# EAGLE design algo_fet16 (EAGLE 4.16)
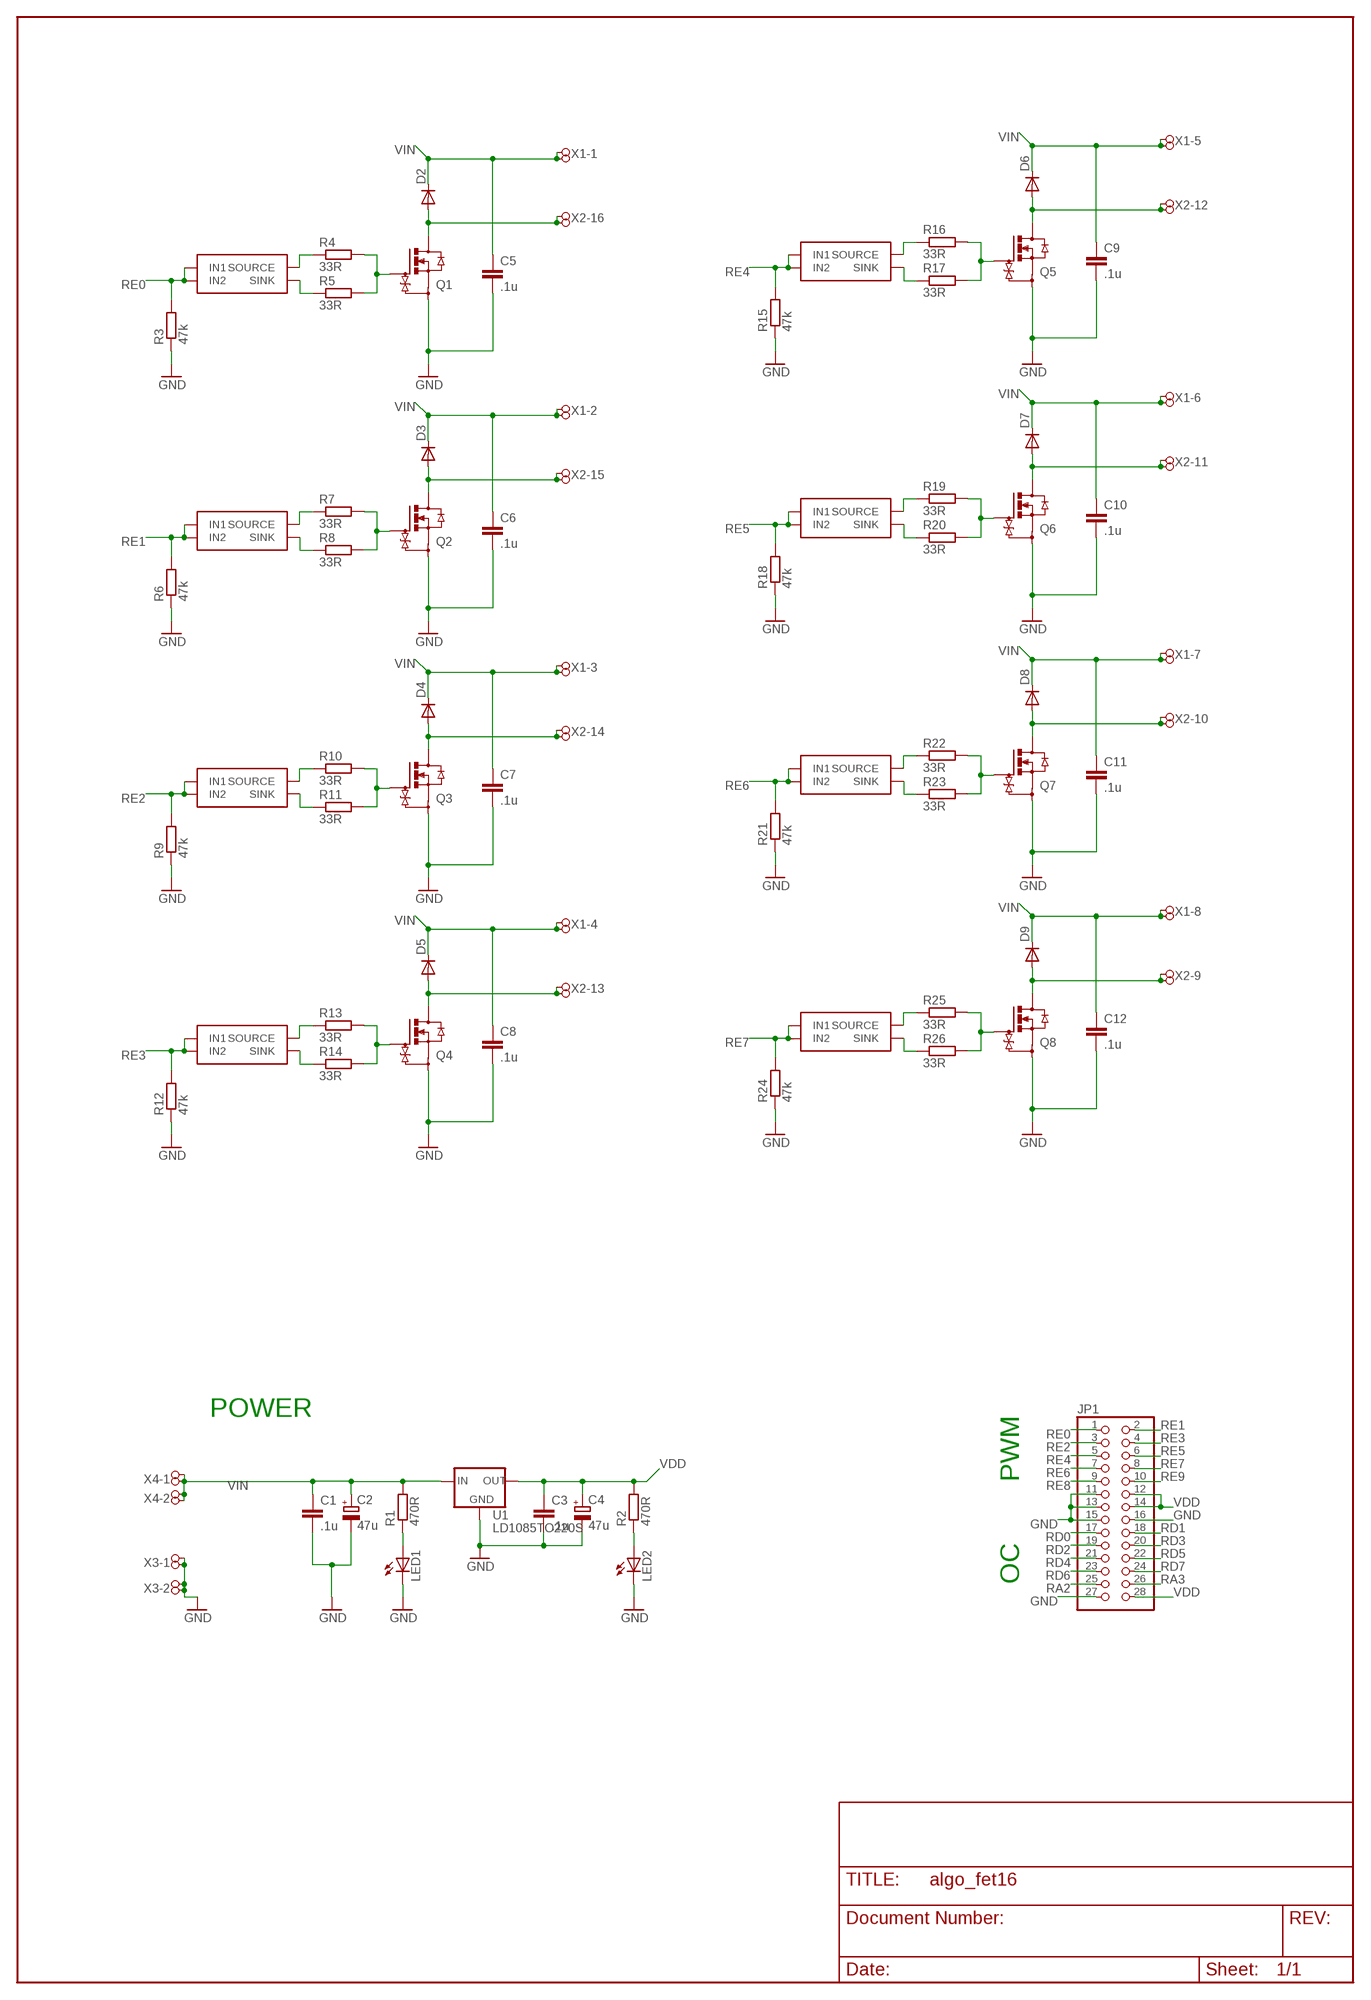
[diagram p0: schematic, sheet 1, part 1 of 2]
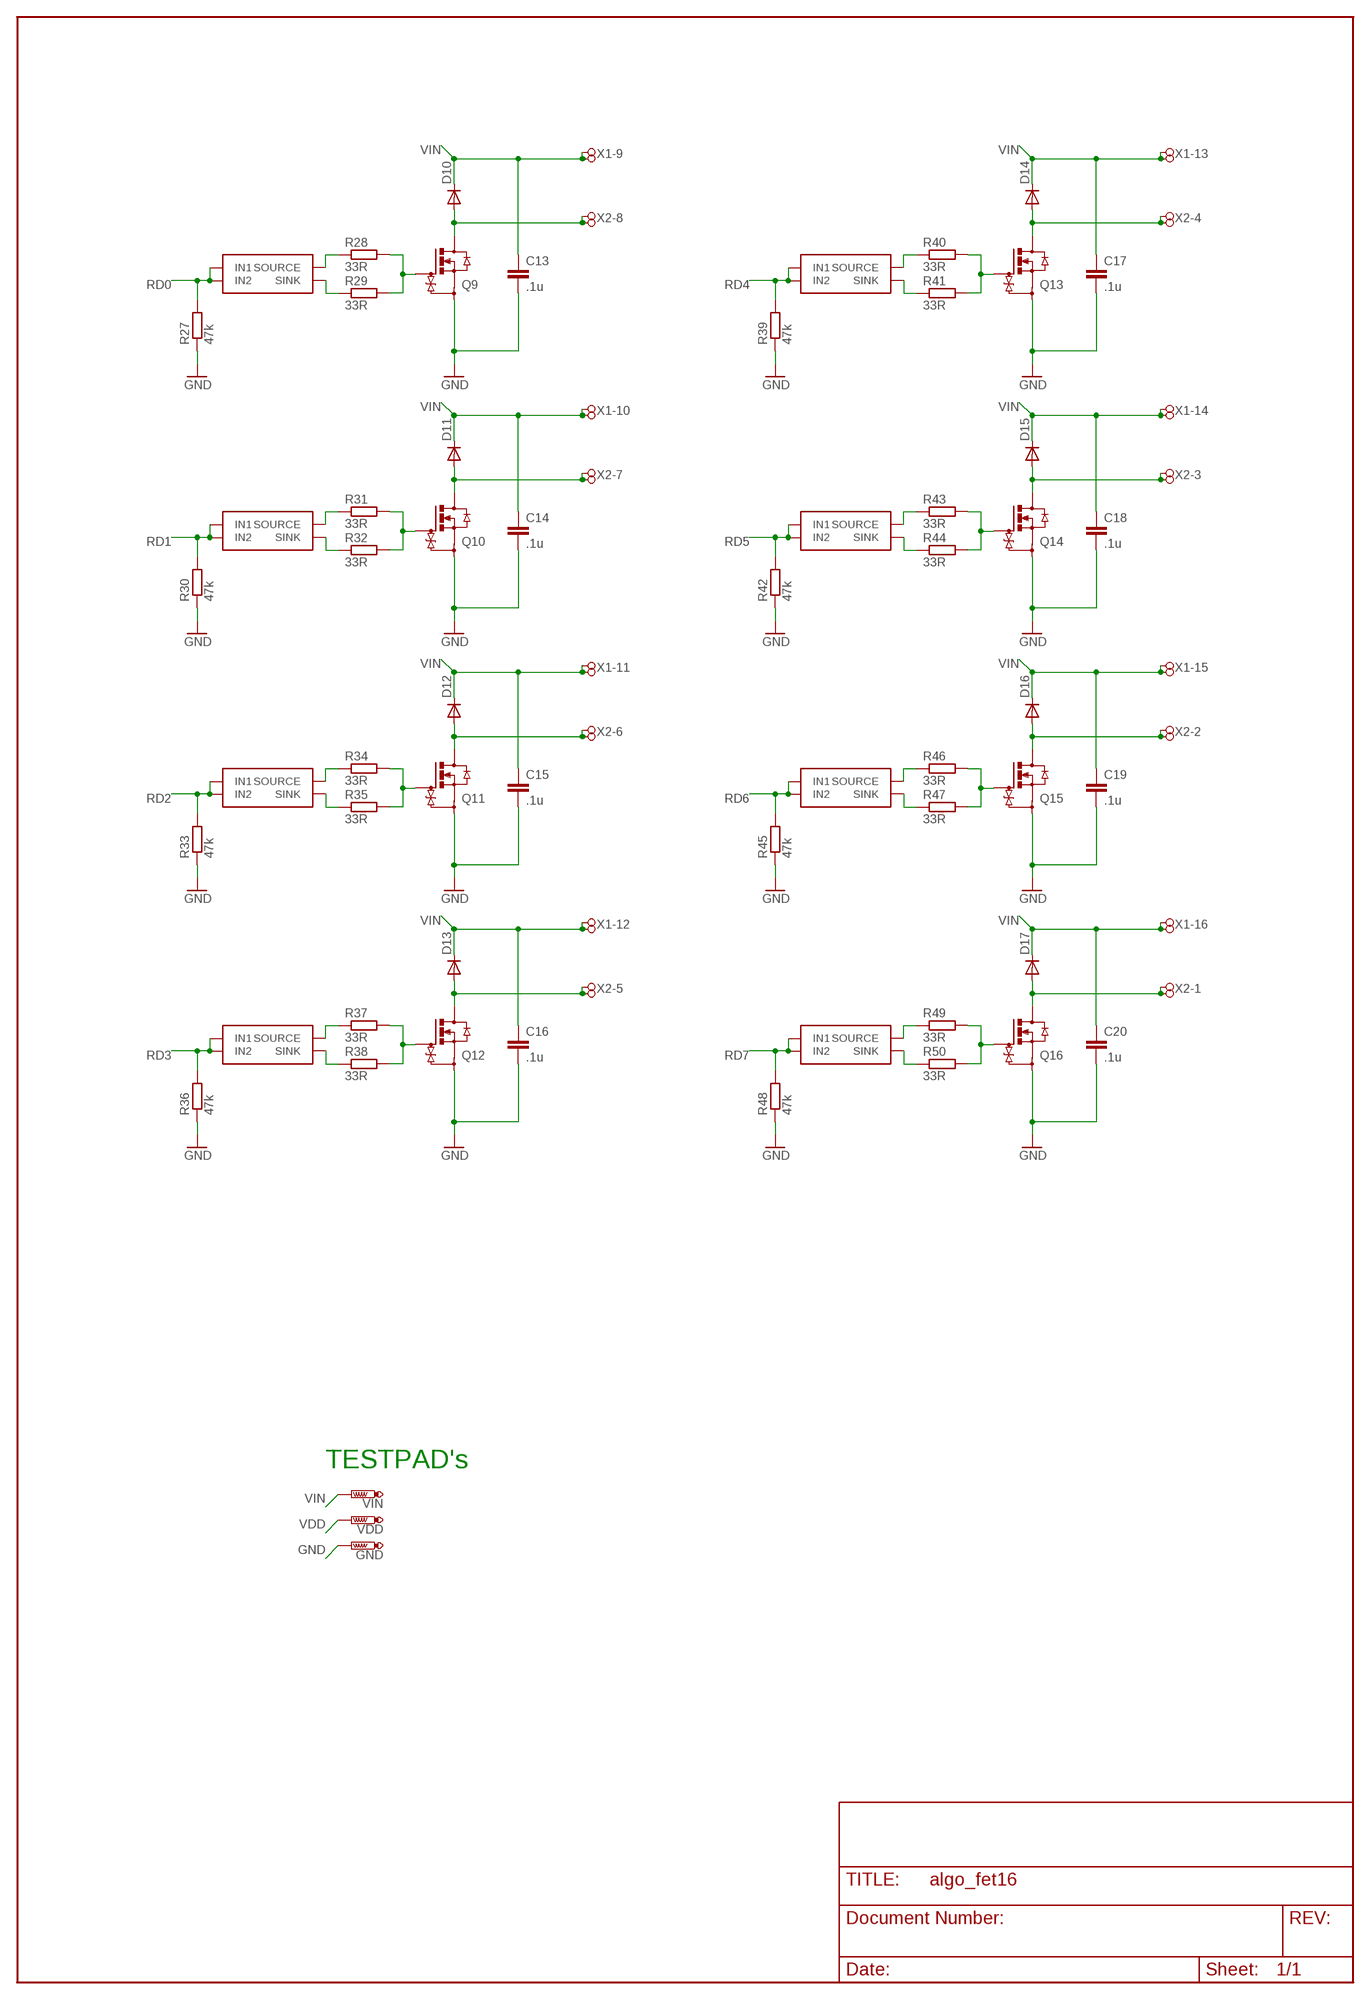
[diagram p1: schematic, sheet 1, part 2 of 2]

## Parts
C1  .1u  C-EUC0805  [C0805]
C2  47u  CPOL-EUE  [PANASONIC_E]
C3  .1u  C-EUC0805  [C0805]
C4  47u  CPOL-EUE  [PANASONIC_E]
C5  .1u  C-EUC0805  [C0805]
C6  .1u  C-EUC0805  [C0805]
C7  .1u  C-EUC0805  [C0805]
C8  .1u  C-EUC0805  [C0805]
C9  .1u  C-EUC0805  [C0805]
C10  .1u  C-EUC0805  [C0805]
C11  .1u  C-EUC0805  [C0805]
C12  .1u  C-EUC0805  [C0805]
C13  .1u  C-EUC0805  [C0805]
C14  .1u  C-EUC0805  [C0805]
C15  .1u  C-EUC0805  [C0805]
C16  .1u  C-EUC0805  [C0805]
C17  .1u  C-EUC0805  [C0805]
C18  .1u  C-EUC0805  [C0805]
C19  .1u  C-EUC0805  [C0805]
C20  .1u  C-EUC0805  [C0805]
D2  DIODE-DO214AC  [DO214AC]
D3  DIODE-DO214AC  [DO214AC]
D4  DIODE-DO214AC  [DO214AC]
D5  DIODE-DO214AC  [DO214AC]
D6  DIODE-DO214AC  [DO214AC]
D7  DIODE-DO214AC  [DO214AC]
D8  DIODE-DO214AC  [DO214AC]
D9  DIODE-DO214AC  [DO214AC]
D10  DIODE-DO214AC  [DO214AC]
D11  DIODE-DO214AC  [DO214AC]
D12  DIODE-DO214AC  [DO214AC]
D13  DIODE-DO214AC  [DO214AC]
D14  DIODE-DO214AC  [DO214AC]
D15  DIODE-DO214AC  [DO214AC]
D16  DIODE-DO214AC  [DO214AC]
D17  DIODE-DO214AC  [DO214AC]
GND  PTR1PAD1-17  [P1-17]
JP1  PINHD-2X14  [2X14]
LED1  LEDSMT1206  [1206]
LED2  LEDSMT1206  [1206]
Q1  RTR040N03  [TSMT3]
Q2  RTR040N03  [TSMT3]
Q3  RTR040N03  [TSMT3]
Q4  RTR040N03  [TSMT3]
Q5  RTR040N03  [TSMT3]
Q6  RTR040N03  [TSMT3]
Q7  RTR040N03  [TSMT3]
Q8  RTR040N03  [TSMT3]
Q9  RTR040N03  [TSMT3]
Q10  RTR040N03  [TSMT3]
Q11  RTR040N03  [TSMT3]
Q12  RTR040N03  [TSMT3]
Q13  RTR040N03  [TSMT3]
Q14  RTR040N03  [TSMT3]
Q15  RTR040N03  [TSMT3]
Q16  RTR040N03  [TSMT3]
R1  470R  R-EU_M0805  [M0805]
R2  470R  R-EU_M0805  [M0805]
R3  47k  R-EU_R0805  [R0805]
R4  33R  R-EU_R1206  [R1206]
R5  33R  R-EU_R1206  [R1206]
R6  47k  R-EU_R0805  [R0805]
R7  33R  R-EU_R1206  [R1206]
R8  33R  R-EU_R1206  [R1206]
R9  47k  R-EU_R0805  [R0805]
R10  33R  R-EU_R1206  [R1206]
R11  33R  R-EU_R1206  [R1206]
R12  47k  R-EU_R0805  [R0805]
R13  33R  R-EU_R1206  [R1206]
R14  33R  R-EU_R1206  [R1206]
R15  47k  R-EU_R0805  [R0805]
R16  33R  R-EU_R1206  [R1206]
R17  33R  R-EU_R1206  [R1206]
R18  47k  R-EU_R0805  [R0805]
R19  33R  R-EU_R1206  [R1206]
R20  33R  R-EU_R1206  [R1206]
R21  47k  R-EU_R0805  [R0805]
R22  33R  R-EU_R1206  [R1206]
R23  33R  R-EU_R1206  [R1206]
R24  47k  R-EU_R0805  [R0805]
R25  33R  R-EU_R1206  [R1206]
R26  33R  R-EU_R1206  [R1206]
R27  47k  R-EU_R0805  [R0805]
R28  33R  R-EU_R1206  [R1206]
R29  33R  R-EU_R1206  [R1206]
R30  47k  R-EU_R0805  [R0805]
R31  33R  R-EU_R1206  [R1206]
R32  33R  R-EU_R1206  [R1206]
R33  47k  R-EU_R0805  [R0805]
R34  33R  R-EU_R1206  [R1206]
R35  33R  R-EU_R1206  [R1206]
R36  47k  R-EU_R0805  [R0805]
R37  33R  R-EU_R1206  [R1206]
R38  33R  R-EU_R1206  [R1206]
R39  47k  R-EU_R0805  [R0805]
R40  33R  R-EU_R1206  [R1206]
R41  33R  R-EU_R1206  [R1206]
R42  47k  R-EU_R0805  [R0805]
R43  33R  R-EU_R1206  [R1206]
R44  33R  R-EU_R1206  [R1206]
R45  47k  R-EU_R0805  [R0805]
R46  33R  R-EU_R1206  [R1206]
R47  33R  R-EU_R1206  [R1206]
R48  47k  R-EU_R0805  [R0805]
R49  33R  R-EU_R1206  [R1206]
R50  33R  R-EU_R1206  [R1206]
U1  LD1085TO220S  [TO220S]
U2  ZXGD3002E6  [SOT23-6]
U3  ZXGD3002E6  [SOT23-6]
U4  ZXGD3002E6  [SOT23-6]
U5  ZXGD3002E6  [SOT23-6]
U6  ZXGD3002E6  [SOT23-6]
U7  ZXGD3002E6  [SOT23-6]
U8  ZXGD3002E6  [SOT23-6]
U9  ZXGD3002E6  [SOT23-6]
U10  ZXGD3002E6  [SOT23-6]
U11  ZXGD3002E6  [SOT23-6]
U12  ZXGD3002E6  [SOT23-6]
U13  ZXGD3002E6  [SOT23-6]
U14  ZXGD3002E6  [SOT23-6]
U15  ZXGD3002E6  [SOT23-6]
U16  ZXGD3002E6  [SOT23-6]
U17  ZXGD3002E6  [SOT23-6]
VDD  PTR1PAD1-17  [P1-17]
VIN  PTR1PAD1-17  [P1-17]
X1  MULTISOCK16  [MULTISOCK_16]
X2  MULTISOCK16  [MULTISOCK_16]
X3  MULTISOCK_2  [MULTISOCK_2]
X4  MULTISOCK_2  [MULTISOCK_2]

## Nets
GND [pwr]: C1.2 C2.- C3.2 C4.- C5.2 C6.2 C7.2 C8.2 C9.2 C10.2 C11.2 C12.2 C13.2 C14.2 C15.2 C16.2 C17.2 C18.2 C19.2 C20.2 GND.1(TP) JP1.11 JP1.13 JP1.15 JP1.16 JP1.27 LED1.C LED2.C Q1.P$2(S) Q2.P$2(S) Q3.P$2(S) Q4.P$2(S) Q5.P$2(S) Q6.P$2(S) Q7.P$2(S) Q8.P$2(S) Q9.P$2(S) Q10.P$2(S) Q11.P$2(S) Q12.P$2(S) Q13.P$2(S) Q14.P$2(S) Q15.P$2(S) Q16.P$2(S) R3.1 R6.1 R9.1 R12.1 R15.1 R18.1 R21.1 R24.1 R27.1 R30.1 R33.1 R36.1 R39.1 R42.1 R45.1 R48.1 U1.1(GND) X3.P$1 X3.P$2 X3.P$3 X3.P$4
N$3: R8.1 U3.P$4(SINK)
N$4: R7.1 U3.P$6(SOURCE)
N$5: Q2.P$1(G) R7.2 R8.2
N$6: D3.A Q2.P$3(D) X2.P$29 X2.P$30
N$9: R11.1 U4.P$4(SINK)
N$10: R10.1 U4.P$6(SOURCE)
N$11: Q3.P$1(G) R10.2 R11.2
N$12: D4.A Q3.P$3(D) X2.P$27 X2.P$28
N$15: R14.1 U5.P$4(SINK)
N$16: R13.1 U5.P$6(SOURCE)
N$19: LED1.A R1.1
N$20: LED2.A R2.1
N$21: R5.1 U2.P$4(SINK)
N$22: R4.1 U2.P$6(SOURCE)
N$23: Q1.P$1(G) R4.2 R5.2
N$24: D2.A Q1.P$3(D) X2.P$31 X2.P$32
N$25: Q4.P$1(G) R13.2 R14.2
N$26: D5.A Q4.P$3(D) X2.P$25 X2.P$26
N$29: R17.1 U6.P$4(SINK)
N$30: R16.1 U6.P$6(SOURCE)
N$31: Q5.P$1(G) R16.2 R17.2
N$32: D6.A Q5.P$3(D) X2.P$23 X2.P$24
N$35: R20.1 U7.P$4(SINK)
N$36: R19.1 U7.P$6(SOURCE)
N$37: Q6.P$1(G) R19.2 R20.2
N$38: D7.A Q6.P$3(D) X2.P$21 X2.P$22
N$41: R23.1 U8.P$4(SINK)
N$42: R22.1 U8.P$6(SOURCE)
N$43: Q7.P$1(G) R22.2 R23.2
N$44: D8.A Q7.P$3(D) X2.P$19 X2.P$20
N$47: R26.1 U9.P$4(SINK)
N$48: R25.1 U9.P$6(SOURCE)
N$49: Q8.P$1(G) R25.2 R26.2
N$50: D9.A Q8.P$3(D) X2.P$17 X2.P$18
N$53: R29.1 U10.P$4(SINK)
N$54: R28.1 U10.P$6(SOURCE)
N$55: Q9.P$1(G) R28.2 R29.2
N$56: D10.A Q9.P$3(D) X2.P$15 X2.P$16
N$59: R32.1 U11.P$4(SINK)
N$60: R31.1 U11.P$6(SOURCE)
N$61: Q10.P$1(G) R31.2 R32.2
N$62: D11.A Q10.P$3(D) X2.P$13 X2.P$14
N$65: R35.1 U12.P$4(SINK)
N$66: R34.1 U12.P$6(SOURCE)
N$67: Q11.P$1(G) R34.2 R35.2
N$68: D12.A Q11.P$3(D) X2.P$11 X2.P$12
N$71: R38.1 U13.P$4(SINK)
N$72: R37.1 U13.P$6(SOURCE)
N$73: Q12.P$1(G) R37.2 R38.2
N$74: D13.A Q12.P$3(D) X2.P$9 X2.P$10
N$77: R41.1 U14.P$4(SINK)
N$78: R40.1 U14.P$6(SOURCE)
N$79: Q13.P$1(G) R40.2 R41.2
N$80: D14.A Q13.P$3(D) X2.P$7 X2.P$8
N$83: R44.1 U15.P$4(SINK)
N$84: R43.1 U15.P$6(SOURCE)
N$85: Q14.P$1(G) R43.2 R44.2
N$86: D15.A Q14.P$3(D) X2.P$5 X2.P$6
N$89: R47.1 U16.P$4(SINK)
N$90: R46.1 U16.P$6(SOURCE)
N$91: Q15.P$1(G) R46.2 R47.2
N$92: D16.A Q15.P$3(D) X2.P$3 X2.P$4
N$95: R50.1 U17.P$4(SINK)
N$96: R49.1 U17.P$6(SOURCE)
N$97: Q16.P$1(G) R49.2 R50.2
N$98: D17.A Q16.P$3(D) X2.P$1 X2.P$2
RA2 [d_signal]: JP1.25
RA3 [d_signal]: JP1.26
RD0 [d_signal]: JP1.17 R27.2 U10.P$2(IN1) U10.P$5(IN2)
RD1 [d_signal]: JP1.18 R30.2 U11.P$2(IN1) U11.P$5(IN2)
RD2 [d_signal]: JP1.19 R33.2 U12.P$2(IN1) U12.P$5(IN2)
RD3 [d_signal]: JP1.20 R36.2 U13.P$2(IN1) U13.P$5(IN2)
RD4 [d_signal]: JP1.21 R39.2 U14.P$2(IN1) U14.P$5(IN2)
RD5 [d_signal]: JP1.22 R42.2 U15.P$2(IN1) U15.P$5(IN2)
RD6 [d_signal]: JP1.23 R45.2 U16.P$2(IN1) U16.P$5(IN2)
RD7 [d_signal]: JP1.24 R48.2 U17.P$2(IN1) U17.P$5(IN2)
RE0 [d_signal]: JP1.1 R3.2 U2.P$2(IN1) U2.P$5(IN2)
RE1 [d_signal]: JP1.2 R6.2 U3.P$2(IN1) U3.P$5(IN2)
RE2 [d_signal]: JP1.3 R9.2 U4.P$2(IN1) U4.P$5(IN2)
RE3 [d_signal]: JP1.4 R12.2 U5.P$2(IN1) U5.P$5(IN2)
RE4 [d_signal]: JP1.5 R15.2 U6.P$2(IN1) U6.P$5(IN2)
RE5 [d_signal]: JP1.6 R18.2 U7.P$2(IN1) U7.P$5(IN2)
RE6 [d_signal]: JP1.7 R21.2 U8.P$2(IN1) U8.P$5(IN2)
RE7 [d_signal]: JP1.8 R24.2 U9.P$2(IN1) U9.P$5(IN2)
RE8 [d_signal]: JP1.9
RE9: JP1.10
VDD [pwr]: C3.1 C4.+ JP1.12 JP1.14 JP1.28 R2.2 U1.2(OUT) VDD.1(TP)
VIN [pwr]: C1.1 C2.+ C5.1 C6.1 C7.1 C8.1 C9.1 C10.1 C11.1 C12.1 C13.1 C14.1 C15.1 C16.1 C17.1 C18.1 C19.1 C20.1 D2.C D3.C D4.C D5.C D6.C D7.C D8.C D9.C D10.C D11.C D12.C D13.C D14.C D15.C D16.C D17.C R1.2 U1.3(IN) VIN.1(TP) X1.P$1 X1.P$2 X1.P$3 X1.P$4 X1.P$5 X1.P$6 X1.P$7 X1.P$8 X1.P$9 X1.P$10 X1.P$11 X1.P$12 X1.P$13 X1.P$14 X1.P$15 X1.P$16 X1.P$17 X1.P$18 X1.P$19 X1.P$20 X1.P$21 X1.P$22 X1.P$23 X1.P$24 X1.P$25 X1.P$26 X1.P$27 X1.P$28 X1.P$29 X1.P$30 X1.P$31 X1.P$32 X4.P$1 X4.P$2 X4.P$3 X4.P$4

## Notes on the sheet
- POWER
- TESTPAD's
- PWM
- OC

## Power pins joined to a net without a drawn wire
GND: U2.P$3(GND) U3.P$3(GND) U4.P$3(GND) U5.P$3(GND) U6.P$3(GND) U7.P$3(GND) U8.P$3(GND) U9.P$3(GND) U10.P$3(GND) U11.P$3(GND) U12.P$3(GND) U13.P$3(GND) U14.P$3(GND) U15.P$3(GND) U16.P$3(GND) U17.P$3(GND)
VDD: U2.P$1(VDD) U3.P$1(VDD) U4.P$1(VDD) U5.P$1(VDD) U6.P$1(VDD) U7.P$1(VDD) U8.P$1(VDD) U9.P$1(VDD) U10.P$1(VDD) U11.P$1(VDD) U12.P$1(VDD) U13.P$1(VDD) U14.P$1(VDD) U15.P$1(VDD) U16.P$1(VDD) U17.P$1(VDD)

## Library data of the parts
C1 C3 C5-C20 = rcl:C-EU: CAPACITOR, European symbol
C2 C4 = rcl:CPOL-EU: POLARIZED CAPACITOR, European symbol
D2-D17 = diode:DIODE-: DIODE
GND VDD VIN = testpad:PTR1: TEST PIN
JP1 = pinhead:PINHD-2X14: PIN HEADER
LED1 LED2 = led:LED: LED OSRAM: - CHIPLED LG R971, LG N971, LY N971, LG Q971, LY Q971, LO R971, LY R971 LH N974, LH R974 LS Q976, LO Q976, LY Q976 LO Q996 - Hyper CHIPLED LW Q18S LB Q993, LB Q99A, LB R99A - SideLED LS A670, LO A670, LY A670, LG A670, LP A670 LB A673, LV A673, LT A673, LW A673 LH A674 LY A675 LS A676, LA A676, LO A676, LY A676, LW A676 LS A679, LY A679, LG A679 - Hyper Micro SIDELED® LS Y876, LA Y876, LO Y876, LY Y876 LT Y87S - SmartLED LW L88C, LW L88S LB L89C, LB L89S, LG L890 LS L89K, LO L89K, LY L89K LS L896, LA L896, LO L896, LY L896 - TOPLED LS T670, LO T670, LY T670, LG T670, LP T670 LSG T670, LSP T670, LSY T670, LOP T670, LYG T670 LG T671, LOG T671, LSG T671 LB T673, LV T673, LT T673, LW T673 LH T674 LS T676, LA T676, LO T676, LY T676, LB T676, LH T676, LSB T676, LW T676 LB T67C, LV T67C, LT T67C, LS T67K, LO T67K, LY T67K, LW E67C LS E67B, LA E67B, LO E67B, LY E67B, LB E67C, LV E67C, LT E67C LW T67C LS T679, LY T679, LG T679 LS T770, LO T770, LY T770, LG T770, LP T770 LB T773, LV T773, LT T773, LW T773 LH T774 LS E675, LA E675, LY E675, LS T675 LS T776, LA T776, LO T776, LY T776, LB T776 LHGB T686 LT T68C, LB T68C - Hyper Mini TOPLED® LB M676 - Mini TOPLED Santana® LG M470 LS M47K, LO M47K, LY M47K Source: http://www.osram.convergy.de - LUMILED® LXK2-PW12-R00, LXK2-PW12-S00, LXK2-PW14-U00, LXK2-PW14-V00 LXK2-PM12-R00, LXK2-PM12-S00, LXK2-PM14-U00 LXK2-PE12-Q00, LXK2-PE12-R00, LXK2-PE12-S00, LXK2-PE14-T00, LXK2-PE14-U00 LXK2-PB12-K00, LXK2-PB12-L00, LXK2-PB12-M00, LXK2-PB14-N00, LXK2-PB14-P00, LXK2-PB14-Q00 LXK2-PR12-L00, LXK2-PR12-M00, LXK2-PR14-Q00, LXK2-PR14-R00 LXK2-PD12-Q00, LXK2-PD12-R00, LXK2-PD12-S00 LXK2-PH12-R00, LXK2-PH12-S00 LXK2-PL12-P00, LXK2-PL12-Q00, LXK2-PL12-R00 Source: www.luxeon.com
Q1-Q16 = eigene:RTR040N03
R1-R50 = rcl:R-EU_: RESISTOR, European symbol
U1 = v-reg-mich:LD1085
U2-U17 = eigene:ZXGD3002E6
X1 X2 = eigene:MULTISOCK16
X3 X4 = eigene:MULTISOCK_2

## Net classes
0 default: width 0.254 mm
1 d_signal: width 0.406 mm, clearance 0.406 mm
2 a_signal: width 0.406 mm
3 pwr: width 0.406 mm, drill 0.254 mm, clearance 0.305 mm
5 3v3: width 0.254 mm

## Board
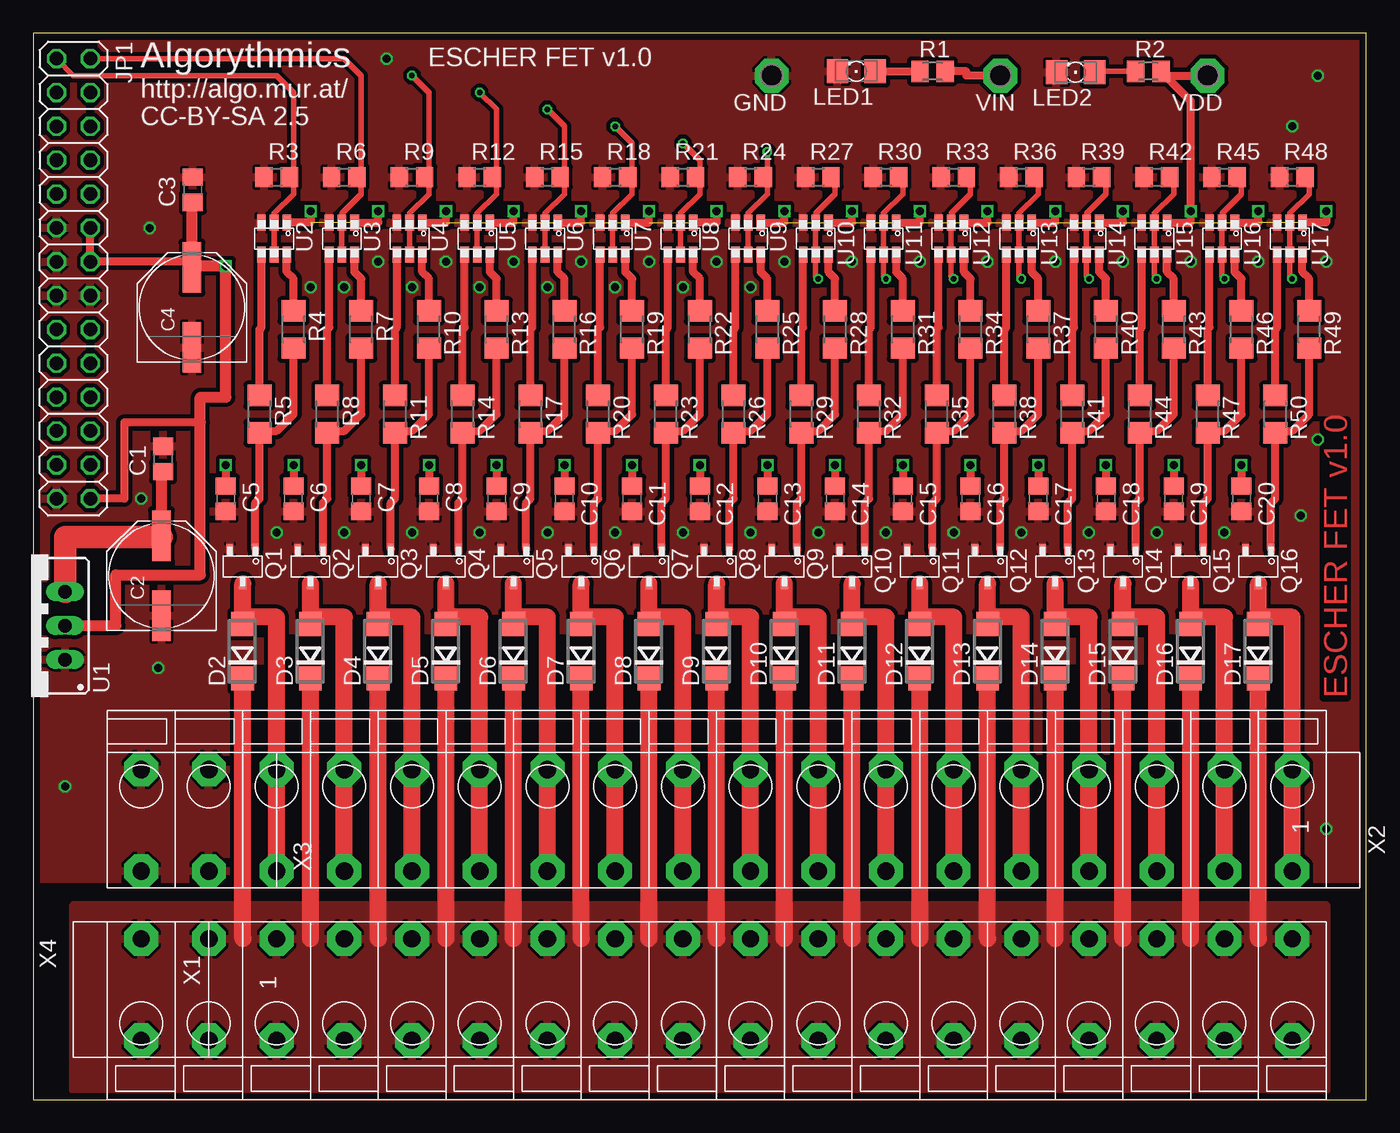
[diagram p2: board, top side]
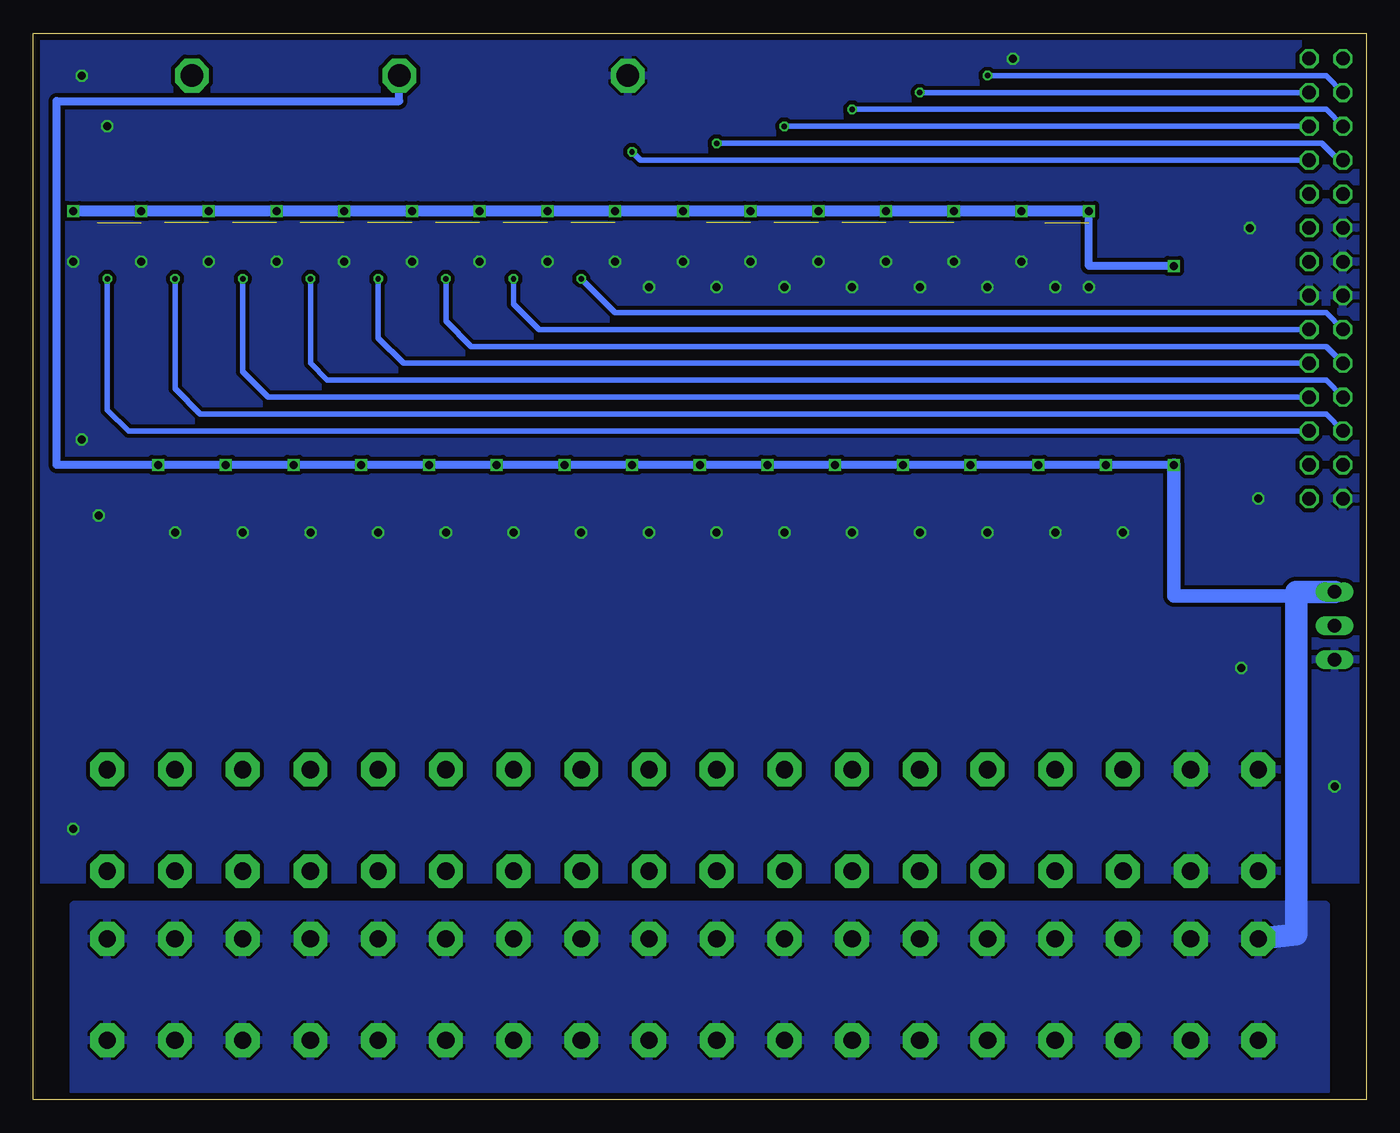
[diagram p3: board, bottom side, seen from below]

Size 100 x 80 mm. Coordinates in mm from the lower left corner, seen from the top.
Outline: 0,0 100,0 100,80 0,80 0,0
Copper layers (1*16): Top 0.035mm / dielectric 1.5mm / Bottom 0.035mm
Design rules "PCB-POOL": minimum track width 6mil, minimum drill 12mil, track to track 6mil, track to pad 6mil, pad to pad 6mil, via to via 6mil, smd to smd 6mil, copper to edge 20mil, drill to drill 8mil, minimum pad ring 8mil, minimum via ring 6mil, stop-mask expansion 3mil, vias tented up to drill 0mil, thermal gap 8mil

### Footprints (pad centres in the part's own frame; a part is rotated, then mirrored left to right if it is on the bottom)
C0805 = smd 1.3 x 1.5: 1 -0.95,0; 2 0.95,0
PANASONIC_E = smd 3.8 x 1.4: + 3,0; - -3,0
DO214AC = smd 1.8 x 1.7: A 2.05,0; C -2.05,0
P1-17 = drill 1.702 pad 2.54 octagon: 1 0,0
2X14 = drill 1.016 octagon: 1 -16.51,-1.27; 2 -16.51,1.27; 3 -13.97,-1.27; 4 -13.97,1.27; 5 -11.43,-1.27; 6 -11.43,1.27; 7 -8.89,-1.27; 8 -8.89,1.27; 9 -6.35,-1.27; 10 -6.35,1.27; 11 -3.81,-1.27; 12 -3.81,1.27; 13 -1.27,-1.27; 14 -1.27,1.27; 15 1.27,-1.27; 16 1.27,1.27; 17 3.81,-1.27; 18 3.81,1.27; 19 6.35,-1.27; 20 6.35,1.27; 21 8.89,-1.27; 22 8.89,1.27; 23 11.43,-1.27; 24 11.43,1.27; 25 13.97,-1.27; 26 13.97,1.27; 27 16.51,-1.27; 28 16.51,1.27
1206 = smd 1.6 x 1.803: A -1.422,0; C 1.422,0
TSMT3 = smd 0.5 x 0.8: P$1 -0.95,-1.3; P$2 0.95,-1.3; P$3 0,1.3
M0805 = smd 1.3 x 1.6: 1 -0.95,0; 2 0.95,0
R0805 = smd 1.3 x 1.5: 1 -0.95,0; 2 0.95,0
R1206 = smd 1.6 x 1.8: 1 -1.4,0; 2 1.4,0
TO220S = drill 1.016 long: 1 -2.54,-2.54; 2 0,-2.54; 3 2.54,-2.54
SOT23-6 = smd 0.65 x 1.2: P$1 0.5,-0.4; P$2 1.45,-0.4; P$3 2.4,-0.4; P$4 2.4,2; P$5 1.45,2; P$6 0.5,2
MULTISOCK_16 = drill 1.3 pad 2.54 octagon: P$1 3.81,11.43; P$2 3.81,3.81; P$3 8.89,11.43; P$4 8.89,3.81; P$5 13.97,11.43; P$6 13.97,3.81; P$7 19.05,11.43; P$8 19.05,3.81; P$9 24.13,11.43; P$10 24.13,3.81; P$11 29.21,11.43; P$12 29.21,3.81; P$13 34.29,11.43; P$14 34.29,3.81; P$15 39.37,11.43; P$16 39.37,3.81; P$17 44.45,11.43; P$18 44.45,3.81; P$19 49.53,11.43; P$20 49.53,3.81; P$21 54.61,11.43; P$22 54.61,3.81; P$23 59.69,11.43; P$24 59.69,3.81; P$25 64.77,11.43; P$26 64.77,3.81; P$27 69.85,11.43; P$28 69.85,3.81; P$29 74.93,11.43; P$30 74.93,3.81; P$31 80.01,11.43; P$32 80.01,3.81
MULTISOCK_2 = drill 1.3 pad 2.54 octagon: P$1 0,7.62; P$2 0,0; P$3 5.08,7.62; P$4 5.08,0

### Placement (x,y rotation side)
C1  9.74,48.06 90 top
C2  9.61,39.3 90 top
C3  11.96,68.26 90 top
C4  11.9,59.43 90 top
C5  14.44,45.08 270 top
C6  19.52,45.08 270 top
C7  24.6,45.08 270 top
C8  29.68,45.08 270 top
C9  34.76,45.08 270 top
C10  39.84,45.08 270 top
C11  44.92,45.08 270 top
C12  50,45.08 270 top
C13  55.08,45.08 270 top
C14  60.16,45.08 270 top
C15  65.24,45.08 270 top
C16  70.32,45.08 270 top
C17  75.4,45.08 270 top
C18  80.48,45.08 270 top
C19  85.56,45.08 270 top
C20  90.64,45.08 270 top
D2  15.71,33.65 90 top
D3  20.79,33.65 90 top
D4  25.87,33.65 90 top
D5  30.95,33.65 90 top
D6  36.03,33.65 90 top
D7  41.11,33.65 90 top
D8  46.19,33.65 90 top
D9  51.27,33.65 90 top
D10  56.35,33.65 90 top
D11  61.43,33.65 90 top
D12  66.51,33.65 90 top
D13  71.59,33.65 90 top
D14  76.67,33.65 90 top
D15  81.75,33.65 90 top
D16  86.83,33.65 90 top
D17  91.91,33.65 90 top
GND  55.4,76.83 180 top
JP1  3.01,61.59 270 top
LED1  61.75,77.15 180 top
LED2  78.19,77.08 180 top
Q1  15.71,40 180 top
Q2  20.79,40 180 top
Q3  25.87,40 180 top
Q4  30.95,40 180 top
Q5  36.03,40 180 top
Q6  41.11,40 180 top
Q7  46.19,40 180 top
Q8  51.27,40 180 top
Q9  56.35,40 180 top
Q10  61.43,40 180 top
Q11  66.51,40 180 top
Q12  71.59,40 180 top
Q13  76.67,40 180 top
Q14  81.75,40 180 top
Q15  86.83,40 180 top
Q16  91.91,40 180 top
R1  67.46,77.15 0 top
R2  83.66,77.15 0 top
R3  18.25,69.21 0 top
R4  19.52,57.78 270 top
R5  16.98,51.43 270 top
R6  23.33,69.21 0 top
R7  24.6,57.78 270 top
R8  22.06,51.43 270 top
R9  28.41,69.21 0 top
R10  29.68,57.78 270 top
R11  27.14,51.43 270 top
R12  33.49,69.21 0 top
R13  34.76,57.78 270 top
R14  32.22,51.43 270 top
R15  38.57,69.21 0 top
R16  39.84,57.78 270 top
R17  37.3,51.43 270 top
R18  43.65,69.21 0 top
R19  44.92,57.78 270 top
R20  42.38,51.43 270 top
R21  48.73,69.21 0 top
R22  50,57.78 270 top
R23  47.46,51.43 270 top
R24  53.81,69.21 0 top
R25  55.08,57.78 270 top
R26  52.54,51.43 270 top
R27  58.89,69.21 0 top
R28  60.16,57.78 270 top
R29  57.62,51.43 270 top
R30  63.97,69.21 0 top
R31  65.24,57.78 270 top
R32  62.7,51.43 270 top
R33  69.05,69.21 0 top
R34  70.32,57.78 270 top
R35  67.78,51.43 270 top
R36  74.13,69.21 0 top
R37  75.4,57.78 270 top
R38  72.86,51.43 270 top
R39  79.21,69.21 0 top
R40  80.48,57.78 270 top
R41  77.94,51.43 270 top
R42  84.29,69.21 0 top
R43  85.56,57.78 270 top
R44  83.02,51.43 270 top
R45  89.37,69.21 0 top
R46  90.64,57.78 270 top
R47  88.1,51.43 270 top
R48  94.45,69.21 0 top
R49  95.72,57.78 270 top
R50  93.18,51.43 270 top
U1  -0.17,35.55 90 top
U2  19.52,65.4 180 top
U3  24.6,65.4 180 top
U4  29.68,65.4 180 top
U5  34.76,65.4 180 top
U6  39.84,65.4 180 top
U7  44.92,65.4 180 top
U8  50,65.4 180 top
U9  55.08,65.4 180 top
U10  60.16,65.4 180 top
U11  65.24,65.4 180 top
U12  70.32,65.4 180 top
U13  75.4,65.4 180 top
U14  80.48,65.4 180 top
U15  85.56,65.4 180 top
U16  90.64,65.4 180 top
U17  95.72,65.4 180 top
VDD  88.1,76.83 180 top
VIN  72.54,76.83 180 top
X1  14.44,0.63 0 top
X2  98.26,28.57 180 top
X3  13.17,24.76 180 top
X4  8.09,4.44 0 top

### Tracks (layer width: path | path; a pad name or v marks a point on that pad's centre or on a via)
GND  (via drill 0.6)
  other vias: 2.38,23.49 9.36,32.38 8.09,45.08 8.73,65.4 26.5,78.1 96.99,62.86 91.91,62.86 86.83,62.86 81.75,62.86 76.67,62.86 71.59,62.86 66.51,62.86 61.43,62.86 56.35,62.86 51.27,62.86 46.19,62.86 41.11,62.86 36.03,62.86 30.95,62.86 25.87,62.86 20.79,60.96 23.33,60.96 28.41,60.96 33.49,60.96 38.57,60.96 43.65,60.96 48.73,60.96 53.81,60.96 96.36,76.83 94.45,73.02 96.36,49.53 95.08,43.81 89.37,42.54 84.29,42.54 79.21,42.54 74.13,42.54 69.05,42.54 63.97,42.54 58.89,42.54 53.81,42.54 48.73,42.54 43.65,42.54 38.57,42.54 33.49,42.54 28.41,42.54 23.33,42.54 18.25,42.54 96.99,20.31
  pour Top: 0.15,79.69 100.16,79.69 100.16,16.5 0.15,16.5
  pour Bottom: 0.15,79.69 100.16,79.69 100.16,16.5 0.15,16.5
N$3
  Top 0.406: R8.1 22.06,52.7
  Top 0.61: U3.P$4 22.2,57.92 22.06,57.78 R8.1
N$4
  Top 0.406: R7.1 24.6,59.05
  Top 0.61: U3.P$6 24.1,62.09 24.6,61.59 R7.1
N$5
  Top 0.406: R8.2 22.06,50.16 | R7.2 24.6,56.51
  Top 0.61: Q2.P$1 21.74,44.76 22.06,45.08 R8.2 | 22.06,50.16 23.33,50.16 24.6,51.43 R7.2
N$6
  Top 0.813: 20.79,36.19 D3.A
  Top 1.27: X2.P$29 X2.P$30 23.33,36.19 20.79,36.19 Q2.P$3
N$9
  Top 0.406: R11.1 27.14,52.7
  Top 0.61: U4.P$4 27.28,57.92 27.14,57.78 R11.1
N$10
  Top 0.406: R10.1 29.68,59.05
  Top 0.61: U4.P$6 29.18,62.09 29.68,61.59 R10.1
N$11
  Top 0.406: R11.2 27.14,50.16 | R10.2 29.68,56.51
  Top 0.61: Q3.P$1 26.82,44.76 27.14,45.08 R11.2 | 27.14,50.16 28.41,50.16 29.68,51.43 R10.2
N$12
  Top 0.813: 25.87,36.19 D4.A
  Top 1.27: X2.P$27 X2.P$28 28.41,36.19 25.87,36.19 Q3.P$3
N$15
  Top 0.406: R14.1 32.22,52.7
  Top 0.61: U5.P$4 32.36,57.92 32.22,57.78 R14.1
N$16
  Top 0.406: R13.1 34.76,59.05
  Top 0.61: U5.P$6 34.26,62.09 34.76,61.59 R13.1
N$19
  Top 0.61: LED1.A R1.1
N$20
  Top 0.406: 83.02,77.15 R2.1 79.53,77.15 79.59,77.08 LED2.A
N$21
  Top 0.406: R5.1 16.98,52.7
  Top 0.61: U2.P$4 17.12,57.92 16.98,57.78 R5.1
N$22
  Top 0.406: R4.1 19.52,59.05
  Top 0.61: U2.P$6 19.02,62.09 19.52,61.59 R4.1
N$23
  Top 0.406: R5.2 16.98,50.16 | R4.2 19.52,56.51
  Top 0.61: Q1.P$1 16.66,44.76 16.98,45.08 R5.2 | 16.98,50.16 18.25,50.16 19.52,51.43 R4.2
N$24
  Top 0.813: 15.71,36.19 D2.A
  Top 1.27: X2.P$31 X2.P$32 18.25,36.19 15.71,36.19 Q1.P$3
N$25
  Top 0.406: R14.2 32.22,50.16 | R13.2 34.76,56.51
  Top 0.61: Q4.P$1 31.9,44.76 32.22,45.08 R14.2 | 32.22,50.16 33.49,50.16 34.76,51.43 R13.2
N$26
  Top 0.813: 30.95,36.19 D5.A
  Top 1.27: X2.P$25 X2.P$26 33.49,36.19 30.95,36.19 Q4.P$3
N$29
  Top 0.406: 37.3,57.78 37.44,57.92 | R17.1 37.3,52.7
  Top 0.61: 37.44,57.92 U6.P$4 | R17.1 37.3,57.78
N$30
  Top 0.406: R16.1 39.84,59.05
  Top 0.61: U6.P$6 39.34,62.09 39.84,61.59 R16.1
N$31
  Top 0.406: R17.2 37.3,50.16 | R16.2 39.84,56.51
  Top 0.61: Q5.P$1 36.98,44.76 37.3,45.08 R17.2 | 37.3,50.16 38.57,50.16 39.84,51.43 R16.2
N$32
  Top 0.813: 36.03,36.19 D6.A
  Top 1.27: X2.P$23 X2.P$24 38.57,36.19 36.03,36.19 Q5.P$3
N$35
  Top 0.406: 42.38,57.78 42.52,57.92 | R20.1 42.38,52.7
  Top 0.61: 42.52,57.92 U7.P$4 | R20.1 42.38,57.78
N$36
  Top 0.406: R19.1 44.92,59.05
  Top 0.61: U7.P$6 44.42,62.09 44.92,61.59 R19.1
N$37
  Top 0.406: R20.2 42.38,50.16 | R19.2 44.92,56.51
  Top 0.61: Q6.P$1 42.06,44.76 42.38,45.08 R20.2 | 42.38,50.16 43.65,50.16 44.92,51.43 R19.2
N$38
  Top 0.813: 41.11,36.19 D7.A
  Top 1.27: X2.P$21 X2.P$22 43.65,36.19 41.11,36.19 Q6.P$3
N$41
  Top 0.406: R23.1 47.46,52.7
  Top 0.61: U8.P$4 47.6,57.92 47.46,57.78 R23.1
N$42
  Top 0.406: R22.1 50,59.05
  Top 0.61: U8.P$6 49.5,62.09 50,61.59 R22.1
N$43
  Top 0.406: R23.2 47.46,50.16 | R22.2 50,56.51
  Top 0.61: Q7.P$1 47.14,44.76 47.46,45.08 R23.2 | 47.46,50.16 48.73,50.16 50,51.43 R22.2
N$44
  Top 0.813: 46.19,36.19 D8.A | X2.P$19 X2.P$20
  Top 1.27: X2.P$19 X2.P$20 48.73,36.19 46.19,36.19 Q7.P$3
N$47
  Top 0.406: R26.1 52.54,52.7
  Top 0.61: U9.P$4 52.68,57.92 52.54,57.78 R26.1
N$48
  Top 0.406: R25.1 55.08,59.05
  Top 0.61: U9.P$6 54.58,62.09 55.08,61.59 R25.1
N$49
  Top 0.406: R26.2 52.54,50.16 | R25.2 55.08,56.51
  Top 0.61: Q8.P$1 52.22,44.76 52.54,45.08 R26.2 | 52.54,50.16 53.81,50.16 55.08,51.43 R25.2
N$50
  Top 0.813: 51.27,36.19 D9.A | X2.P$17 X2.P$18
  Top 1.27: X2.P$17 X2.P$18 53.81,36.19 51.27,36.19 Q8.P$3
N$53
  Top 0.406: 57.62,57.78 57.76,57.92 | R29.1 57.62,52.7
  Top 0.61: 57.76,57.92 U10.P$4 | R29.1 57.62,57.78
N$54
  Top 0.406: R28.1 60.16,59.05
  Top 0.61: U10.P$6 59.66,62.09 60.16,61.59 R28.1
N$55
  Top 0.406: R29.2 57.62,50.16 | R28.2 60.16,56.51
  Top 0.61: Q9.P$1 57.3,44.76 57.62,45.08 R29.2 | 57.62,50.16 58.89,50.16 60.16,51.43 R28.2
N$56
  Top 0.813: 56.35,36.19 D10.A
  Top 1.27: X2.P$15 X2.P$16 58.89,36.19 56.35,36.19 Q9.P$3
N$59
  Top 0.406: R32.1 62.7,52.7
  Top 0.61: U11.P$4 62.84,57.92 62.7,57.78 R32.1
N$60
  Top 0.406: R31.1 65.24,59.05
  Top 0.61: U11.P$6 64.74,62.09 65.24,61.59 R31.1
N$61
  Top 0.406: R32.2 62.7,50.16 | R31.2 65.24,56.51
  Top 0.61: Q10.P$1 62.38,44.76 62.7,45.08 R32.2 | 62.7,50.16 63.97,50.16 65.24,51.43 R31.2
N$62
  Top 0.813: 61.43,36.19 D11.A
  Top 1.27: X2.P$13 X2.P$14 63.97,36.19 61.43,36.19 Q10.P$3
N$65
  Top 0.406: 67.78,57.78 67.92,57.92 | R35.1 67.78,52.7
  Top 0.61: 67.92,57.92 U12.P$4 | R35.1 67.78,57.78
N$66
  Top 0.406: R34.1 70.32,59.05
  Top 0.61: U12.P$6 69.82,62.09 70.32,61.59 R34.1
N$67
  Top 0.406: R35.2 67.78,50.16 | R34.2 70.32,56.51
  Top 0.61: Q11.P$1 67.46,44.76 67.78,45.08 R35.2 | 67.78,50.16 69.05,50.16 70.32,51.43 R34.2
N$68
  Top 0.813: 66.51,36.19 D12.A
  Top 1.27: X2.P$11 X2.P$12 69.05,36.19 66.51,36.19 Q11.P$3
N$71
  Top 0.406: R38.1 72.86,52.7
  Top 0.61: U13.P$4 73,57.92 72.86,57.78 R38.1
N$72
  Top 0.406: R37.1 75.4,59.05
  Top 0.61: U13.P$6 74.9,62.09 75.4,61.59 R37.1
N$73
  Top 0.406: R38.2 72.86,50.16 | R37.2 75.4,56.51
  Top 0.61: Q12.P$1 72.54,44.76 72.86,45.08 R38.2 | 72.86,50.16 74.13,50.16 75.4,51.43 R37.2
N$74
  Top 0.813: 71.59,36.19 D13.A
  Top 1.27: X2.P$9 X2.P$10 74.13,36.19 71.59,36.19 Q12.P$3
N$77
  Top 0.406: R41.1 77.94,52.7
  Top 0.61: U14.P$4 78.08,57.92 77.94,57.78 R41.1
N$78
  Top 0.406: R40.1 80.48,59.05
  Top 0.61: U14.P$6 79.98,62.09 80.48,61.59 R40.1
N$79
  Top 0.406: R41.2 77.94,50.16 | R40.2 80.48,56.51
  Top 0.61: Q13.P$1 77.62,44.76 77.94,45.08 R41.2 | 77.94,50.16 79.21,50.16 80.48,51.43 R40.2
N$80
  Top 0.813: 76.67,36.19 D14.A
  Top 1.27: X2.P$7 X2.P$8 79.21,36.19 76.67,36.19 Q13.P$3
N$83
  Top 0.406: R44.1 83.02,52.7
  Top 0.61: U15.P$4 83.16,57.92 83.02,57.78 R44.1
N$84
  Top 0.406: R43.1 85.56,59.05
  Top 0.61: U15.P$6 85.06,62.09 85.56,61.59 R43.1
N$85
  Top 0.406: R44.2 83.02,50.16 | R43.2 85.56,56.51
  Top 0.61: Q14.P$1 82.7,44.76 83.02,45.08 R44.2 | 83.02,50.16 84.29,50.16 85.56,51.43 R43.2
N$86
  Top 0.813: 81.75,36.19 D15.A
  Top 1.27: X2.P$5 X2.P$6 84.29,36.19 81.75,36.19 Q14.P$3
N$89
  Top 0.406: 88.1,57.78 88.24,57.92 | R47.1 88.1,52.7
  Top 0.61: 88.24,57.92 U16.P$4 | R47.1 88.1,57.78
N$90
  Top 0.406: R46.1 90.64,59.05
  Top 0.61: U16.P$6 90.14,62.09 90.64,61.59 R46.1
N$91
  Top 0.406: R47.2 88.1,50.16 | R46.2 90.64,56.51
  Top 0.61: Q15.P$1 87.78,44.76 88.1,45.08 R47.2 | 88.1,50.16 89.37,50.16 90.64,51.43 R46.2
N$92
  Top 0.813: 86.83,36.19 D16.A
  Top 1.27: X2.P$3 X2.P$4 89.37,36.19 86.83,36.19 Q15.P$3
N$95
  Top 0.406: R50.1 93.18,52.7
  Top 0.61: U17.P$4 93.32,57.92 93.18,57.78 R50.1
N$96
  Top 0.406: R49.1 95.72,59.05
  Top 0.61: U17.P$6 95.22,62.09 95.72,61.59 R49.1
N$97
  Top 0.406: R50.2 93.18,50.16 | R49.2 95.72,56.51
  Top 0.61: Q16.P$1 92.86,44.76 93.18,45.08 R50.2 | 93.18,50.16 94.45,50.16 95.72,51.43 R49.2
N$98
  Top 0.813: 91.91,36.19 D17.A
  Top 1.27: X2.P$1 X2.P$2 94.45,36.19 91.91,36.19 Q16.P$3
RD0  (via drill 0.41)
  Top 0.406: R27.2 60.16,69.21 60.16,67.94 58.71,66.49 U10.P$2 U10.P$5 | U10.P$5 | U10.P$5 58.7,61.78 v58.89,61.59
  Bottom 0.406: JP1.17 3.01,59.05 56.35,59.05 v58.89,61.59
RD1  (via drill 0.41)
  Top 0.406: R30.2 65.24,69.21 65.24,67.94 63.79,66.49 U11.P$2 63.78,65.8 63.78,63.4 | 63.78,63.4 63.78,63.37 | 63.78,63.4 U11.P$5 | 63.78,63.4 63.78,61.78 v63.97,61.59
  Bottom 0.406: JP1.18 62.06,57.78 63.97,59.69 v63.97,61.59
RD2  (via drill 0.41)
  Top 0.406: R33.2 70.32,69.21 70.32,67.94 68.87,66.49 U12.P$2 68.86,65.8 68.86,63.4 | 68.86,63.4 U12.P$5 | 68.86,63.4 68.86,61.78 v69.05,61.59
  Bottom 0.406: v69.05,61.59 69.05,58.41 67.14,56.51 3.01,56.51 JP1.19
RD3  (via drill 0.41)
  Top 0.406: R36.2 75.4,69.21 75.4,67.94 73.95,66.49 U13.P$2 73.94,65.8 73.94,63.4 | 73.94,63.4 U13.P$5 | 73.94,63.4 73.94,61.78 v74.13,61.59
  Bottom 0.406: JP1.20 72.22,55.24 74.13,57.15 v74.13,61.59
RD4  (via drill 0.41)
  Top 0.406: R39.2 80.48,69.21 80.48,67.94 79.03,66.49 U14.P$2 U14.P$5 | U14.P$5 | U14.P$5 79.02,61.78 v79.21,61.59
  Bottom 0.406: v79.21,61.59 79.21,55.24 77.94,53.97 3.01,53.97 JP1.21
RD5  (via drill 0.41)
  Top 0.406: R42.2 85.56,69.21 85.56,67.94 84.11,66.49 U15.P$2 U15.P$5 | U15.P$5 | U15.P$5 84.1,61.78 v84.29,61.59
  Bottom 0.406: JP1.22 82.39,52.7 84.29,54.61 v84.29,61.59
RD6  (via drill 0.41)
  Top 0.406: R45.2 90.64,69.21 90.64,67.94 89.19,66.49 U16.P$2 U16.P$5 | U16.P$5 | U16.P$5 89.18,61.78 v89.37,61.59
  Bottom 0.406: v89.37,61.59 89.37,53.34 87.47,51.43 3.01,51.43 JP1.23
RD7  (via drill 0.41)
  Top 0.406: U17.P$5 | U17.P$5 U17.P$2 94.27,66.49 95.72,67.94 95.72,69.21 R48.2 | U17.P$5 94.26,61.78 v94.45,61.59
  Bottom 0.406: JP1.24 92.86,50.16 94.45,51.75 v94.45,61.59
RE0
  Top 0.406: 19.52,69.21 R3.2 | 19.52,69.21 19.52,67.94 18.07,66.49 U2.P$2 U2.P$5 | JP1.1 3.01,76.83 18.25,76.83 19.52,75.56 19.52,69.21
RE1
  Top 0.406: 24.6,69.21 R6.2 | 24.6,69.21 24.6,67.94 23.15,66.49 U3.P$2 U3.P$5 | U3.P$5 23.14,63.37 | U3.P$5 | JP1.2 23.33,78.1 24.6,76.83 24.6,69.21
RE2  (via drill 0.41)
  Top 0.406: 29.68,69.21 29.68,75.56 v28.41,76.83 | 29.68,69.21 R9.2 | 29.68,69.21 29.68,67.94 28.23,66.49 U4.P$2 28.23,63.38 | 28.23,63.38 U4.P$5 | 28.23,63.38 28.22,63.37
  Bottom 0.406: JP1.3 3.01,76.83 v28.41,76.83
RE3  (via drill 0.41)
  Top 0.406: v33.49,75.56 34.76,74.29 34.76,69.21 | 34.76,69.21 R12.2 | 34.76,69.21 34.76,67.94 33.31,66.49 U5.P$2 33.31,63.44 33.3,63.43 33.31,63.42 U5.P$5
  Bottom 0.406: JP1.4 v33.49,75.56
RE4  (via drill 0.41)
  Top 0.406: v38.57,74.29 39.84,73.02 39.84,69.21 | 39.84,69.21 R15.2 | 39.84,69.21 39.84,67.94 38.39,66.49 U6.P$2 38.39,63.51 38.38,63.5 38.39,63.48 U6.P$5
  Bottom 0.406: JP1.5 3.01,74.29 v38.57,74.29
RE5  (via drill 0.41)
  Top 0.406: v43.65,73.02 44.92,71.75 44.92,69.21 | 44.92,69.21 R18.2 | 44.92,69.21 44.92,67.94 43.47,66.49 U7.P$2 43.47,63.57 43.46,63.56 43.47,63.55 U7.P$5
  Bottom 0.406: JP1.6 v43.65,73.02
RE6  (via drill 0.41)
  Top 0.406: v48.73,71.75 50,70.48 50,69.21 | 50,69.21 R21.2 | 50,69.21 50,67.94 48.55,66.49 U8.P$2 48.55,63.51 48.54,63.5 48.55,63.48 U8.P$5
  Bottom 0.406: JP1.7 2.06,70.48 3.33,71.75 v48.73,71.75
RE7  (via drill 0.41)
  Top 0.406: v55.08,71.11 55.08,69.21 | 55.08,69.21 R24.2 | 55.08,69.21 55.08,67.94 53.63,66.49 U9.P$2 53.63,63.38 | 53.63,63.38 U9.P$5 | 53.63,63.38 53.62,63.37
  Bottom 0.406: JP1.8 54.45,70.48 v55.08,71.11
VDD  (via drill 0.6)  (13 unrouted)
  Top 0.61: U2.P$1 20.79,65.8 v20.79,66.67 | U3.P$1 25.87,65.8 v25.87,66.67 | U4.P$1 30.95,65.8 v30.95,66.67 | U5.P$1 36.03,65.8 v36.03,66.67 | U6.P$1 41.11,65.8 v41.11,66.67 | U7.P$1 46.19,65.8 v46.19,66.67 | U8.P$1 51.27,65.8 v51.27,66.67 | U9.P$1 56.35,65.8 v56.35,66.67 | U10.P$1 61.43,65.8 v61.43,66.67 | U11.P$1 66.51,65.8 v66.51,66.67 | U12.P$1 71.59,65.8 v71.59,66.67 | U13.P$1 76.67,65.8 v76.67,66.67 | U14.P$1 81.75,65.8 v81.75,66.67 | U16.P$1 91.91,65.8 v91.91,66.67 | U17.P$1 96.99,65.8 v96.99,66.67 | U15.P$1 86.83,65.8 v86.83,66.67 | v86.83,66.67 86.83,66.73 | R2.2 84.54,77.21 | R2.2 84.61,76.83 VDD.1 | v86.83,66.67 86.83,74.92 R2.2 | 11.9,67.3 C3.1 | JP1.12 JP1.14 11.9,62.86 11.9,62.54 | JP1.28 6.82,45.08 6.82,50.8 12.54,50.8
  Top 0.813: U1.2 6.18,35.55 6.18,39.37 12.54,39.37 12.54,50.8 12.54,52.7 14.44,52.7 v14.44,62.54 11.9,62.54 | 11.9,62.54 C4.+ | 11.9,62.54 11.9,67.3
  Bottom 0.61: v14.44,62.54 20.79,62.54 v20.79,66.67
  Bottom 0.813: v20.79,66.67 v51.27,66.67 v96.99,66.67
VIN  (via drill 0.6)
  Top 0.61: v14.44,47.62 C5.1 | v19.52,47.62 C6.1 | v24.6,47.62 C7.1 | v29.68,47.62 C8.1 | v34.76,47.62 C9.1 | v39.84,47.62 C10.1 | v44.92,47.62 C11.1 | v50,47.62 C12.1 | v55.08,47.62 C13.1 | v60.16,47.62 C14.1 | v65.24,47.62 C15.1 | v70.32,47.62 C16.1 | v75.4,47.62 C17.1 | v80.48,47.62 C18.1 | v85.56,47.62 C19.1 | v90.64,47.62 C20.1 | C1.1 9.74,46.98 9.61,46.98 | 9.68,42.22 9.61,42.22 C2.+ | VIN.1 70,76.83 70,77.15 R1.2
  Top 0.813: C2.+ 9.61,46.98
  Top 1.27: 15.71,12.06 D2.C | 20.79,12.06 D3.C | 25.87,12.06 D4.C | 30.95,12.06 D5.C | 36.03,12.06 D6.C | 41.11,12.06 D7.C | 46.19,12.06 D8.C | 51.27,12.06 D9.C | 56.35,12.06 D10.C | 61.43,12.06 D11.C | 66.51,12.06 D12.C | 71.59,12.06 D13.C | 76.67,12.06 D14.C | 81.75,12.06 D15.C | 86.83,12.06 D16.C | 91.91,12.06 D17.C
  Top 1.676: 9.61,42.22 2.38,42.22 U1.3
  Bottom 0.61: v14.44,47.62 v19.52,47.62 v24.6,47.62 v29.68,47.62 v34.76,47.62 v39.84,47.62 v44.92,47.62 v50,47.62 v55.08,47.62 v60.16,47.62 v65.24,47.62 v70.32,47.62 v75.4,47.62 v80.48,47.62 v85.56,47.62 v90.64,47.62 98.26,47.62 98.26,74.92 72.54,74.92 VIN.1
  Bottom 1.016: v14.44,47.62 14.44,37.78 5.23,37.78
  Bottom 1.676: U1.3 5.23,38.1 5.23,37.78 5.23,12.38 X4.P$1
  pour Bottom: 3.01,0.63 3.01,14.6 96.99,14.6 96.99,0.63
  pour Top: 3.01,14.6 96.99,14.6 96.99,0.63 3.01,0.63

### Text on the board
Top: ESCHER FET v1.0
tNames: Algorythmics | ESCHER FET v1.0 | http://algo.mur.at/ | CC-BY-SA 2.5